# Altium schematic sheet Analogue_Input.SchDoc
size A4; SheetNumber: 14; SheetTotal: 29
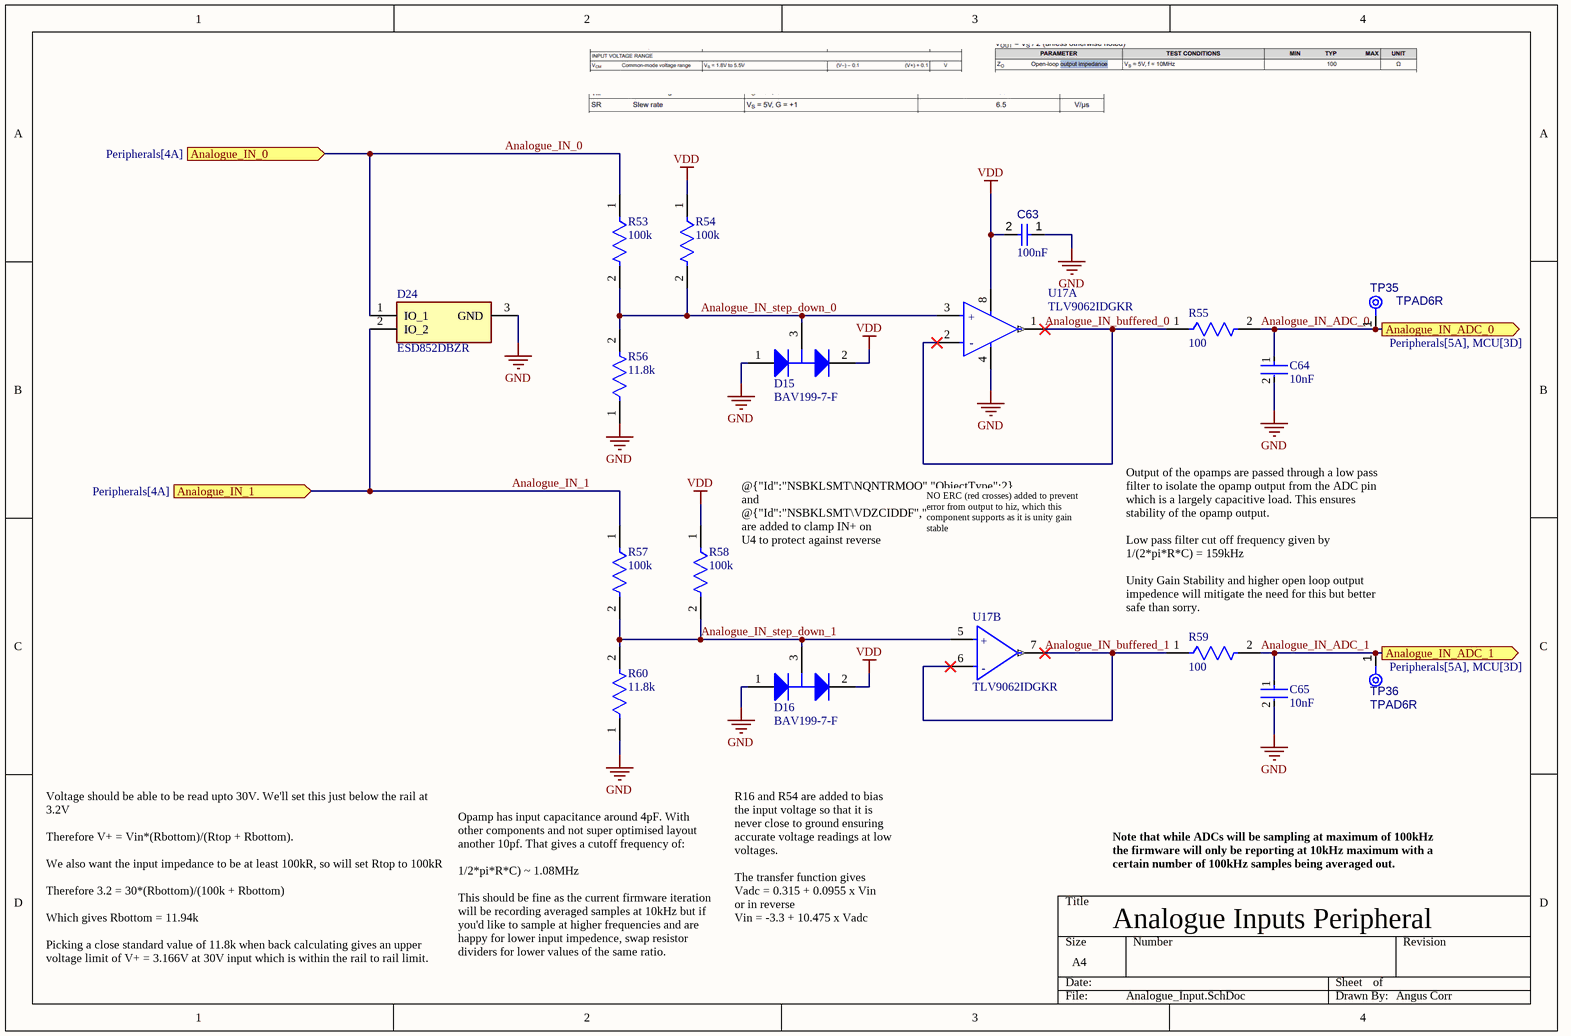
[diagram p0: Analogue_Input.SchDoc]

## Parts
C63  value 100nF  [CAPC1608X90X40NL10T20]  (hidden comment: Capacitor 100 nF +/-10% 50 V 0603)
C64  value 10nF  [FP-CC0603-DA-IPC_B]  (hidden comment: CC0603KRX7R9BB103)
C65  value 10nF  [FP-CC0603-DA-IPC_B]  (hidden comment: CC0603KRX7R9BB103)
D15  BAV199-7-F  [DIOD-SOT23-3_A_V]
D16  BAV199-7-F  [DIOD-SOT23-3_A_V]
D24  ESD852DBZR  [SOT95P237X112-3N]
R53  value 100k  [FP-RT0603-IPC_C]  (hidden comment: RT0603BRE07100KL)
R54  value 100k  [FP-RT0603-IPC_C]  (hidden comment: RT0603BRE07100KL)
R55  value 100  [FP-RT0603-IPC_C]  (hidden comment: RT0603BRD07100RL)
R56  value 11.8k  [FP-RT0603-IPC_A]  (hidden comment: RT0603BRD0711K8L)
R57  value 100k  [FP-RT0603-IPC_C]  (hidden comment: RT0603BRE07100KL)
R58  value 100k  [FP-RT0603-IPC_C]  (hidden comment: RT0603BRE07100KL)
R59  value 100  [FP-RT0603-IPC_C]  (hidden comment: RT0603BRD07100RL)
R60  value 11.8k  [FP-RT0603-IPC_A]  (hidden comment: RT0603BRD0711K8L)
TP35  TPAD6R  [TP06R]  (no BOM)
TP36  TPAD6R  [TP06R]  (no BOM)
U17  TLV9062IDGKR  [FP-DGK0008A-IPC_A]  (parts A,B of 2)

## Ports
Analogue_IN_0 (in, see Peripherals[4A]), Analogue_IN_1 (in, see Peripherals[4A]), Analogue_IN_ADC_0 (out, see Peripherals[5A], MCU[3D]), Analogue_IN_ADC_1 (out, see Peripherals[5A], MCU[3D])

## Nets
GND: C63.1 C64.2 C65.2 D15.1(A) D16.1(A) D24.3(GND) R56.1 R60.1 U17.4(V-)
VDD: C63.2 D15.2(K) D16.2(K) R54.1 R58.1 U17.8(V+)
Analogue_IN_0: D24.1(IO_1) R53.1 ; port Analogue_IN_0
Analogue_IN_1: D24.2(IO_2) R57.1 ; port Analogue_IN_1
Analogue_IN_ADC_0: C64.1 R55.2 TP35.1(TP) ; port Analogue_IN_ADC_0
Analogue_IN_ADC_1: C65.1 R59.2 TP36.1(TP) ; port Analogue_IN_ADC_1
Analogue_IN_buffered_0: R55.1 U17.1(OUT1) U17.2(IN1-)
Analogue_IN_buffered_1: R59.1 U17.6(IN2-) U17.7(OUT2)
Analogue_IN_step_down_0: D15.3(C) R53.2 R54.2 R56.2 U17.3(IN1+)
Analogue_IN_step_down_1: D16.3(C) R57.2 R58.2 R60.2 U17.5(IN2+)

## Notes on the sheet
- (near R58) @{"Id":"NSBKLSMT\NQNTRMOO","ObjectType":2} and @{"Id":"NSBKLSMT\VDZCIDDF","ObjectType":2} are added to clamp IN+ on U4 to protect against reverse bias and overvoltage.
- NO ERC (red crosses) added to prevent error from output to hiz, which this component supports as it is unity gain stable
- Output of the opamps are passed through a low pass filter to isolate the opamp output from the ADC pin which is a largely capacitive load. This ensures stability of the opamp output.
  Low pass filter cut off frequency given by 1/(2*pi*R*C) = 159kHz
  Unity Gain Stability and higher open loop output impedence will mitigate the need for this but better safe than sorry.
- Note that while ADCs will be sampling at maximum of 100kHz the firmware will only be reporting at 10kHz maximum with a certain number of 100kHz samples being averaged out.
- Voltage should be able to be read upto 30V. We'll set this just below the rail at 3.2V
  Therefore V+ = Vin*(Rbottom)/(Rtop + Rbottom).
  We also want the input impedance to be at least 100kR, so will set Rtop to 100kR
  Therefore 3.2 = 30*(Rbottom)/(100k + Rbottom)
  Which gives Rbottom = 11.94k
  Picking a close standard value of 11.8k when back calculating gives an upper voltage limit of V+ = 3.166V at 30V input which is within the rail to rail limit.
- Opamp has input capacitance around 4pF. With other components and not super optimised layout another 10pf. That gives a cutoff frequency of:
  1/2*pi*R*C) ~ 1.08MHz
  This should be fine as the current firmware iteration will be recording averaged samples at 10kHz but if you'd like to sample at higher frequencies and are happy for lower input impedence, swap resistor dividers for lower values of the same ratio.
- R16 and R54 are added to bias the input voltage so that it is never close to ground ensuring accurate voltage readings at low voltages.
  The transfer function gives
  Vadc = 0.315 + 0.0955 x Vin
  or in reverse
  Vin = -3.3 + 10.475 x Vadc
- Analogue Inputs Peripheral
- Angus Corr
- (in symbol CMP-014-00005-1, part A) +; -
- (in symbol CMP-014-00005-1, part B) +; -

## Library data of the parts
C63 = CMP-001-00017-6: Chip Capacitor, 100 nF, +/- 10%, 50 V, 0603 (1608 Metric); Voltage Rating: 50V; Capacitor Type: Ceramic; Tolerance: 10%; Mounting Technology: SM; Max Operating Temperature: 125°C; RoHS Compliant: True; Pins: 2; Case/Package: 0603; Min Operating Temperature: -55°C
C64 C65 = CMP-001-00138-1: 50V 10nF X7R ±10% 0603 Multilayer Ceramic Capacitors MLCC - SMD/SMT ROHS; Insulation Resistance: 100GΩ; Thickness: 889µm; China RoHS: Compliant; Export Control Classification Number (ECCN) Code: EAR99; Termination: SMD/SMT; Radiation Hardening: No; Voltage Rating: 50V; Depth: 800µm; Number of Terminals: 2; Max Operating Temperature: 125°C; Dielectric Material: Ceramic; Voltage Rating (DC): 50V; Dielectric: X7R; Composition: Ceramic; Mounting Technology: Surface Mount; Halogen Free: Halogen Free; Width: 800µm; Case Code (Metric): 1608; Min Operating Temperature: -55°C; Height: 800µm; Schedule B: 8532240020, 8532240020; Introduction Date: 2003-01-27; RoHS: Compliant; Length: 1.6mm; Voltage: 50V; Tolerance: 10%; Lifecycle Status: Production; Case/Package: 0603; Lead Free: Lead Free; Material: Ceramic; Country of Origin: Mainland China, Taiwan; Harmonized Tariff Schedule (HTS) Code: 8532.24.00.20; Case Code (Imperial): 0603; Pins: 2; REACH SVHC: Yes
D15 D16 = CMP-004-00056-1: Diode Standard Recovery Rectifier 85 Volt 0.16A 3-Pin SOT-23 Tape and Reel; Max Surge Current: 4A; Forward Current: 150mA; Forward Voltage: 900mV; Pins: 3; Case/Package: SOT-23; Max Operating Temperature: 150°C; Mounting Technology: Surface Mount; Min Operating Temperature: -65°C
D24 = CMP-031-00025-1: 61V (Typ) Clamp 4.3A (8/20s) Ipp Tvs Diode Surface Mount SOT-23-3; Manufacturer_Name: Texas Instruments; Datasheet Link: https://www.ti.com/lit/ds/symlink/esd852.pdf?ts=1728759309679&ref_url=https%253A%252F%252Fwww.mouser.com%252F; Arrow Price/Stock: https://www.arrow.com/en/products/esd852dbzr/texas-instruments?utm_currency=USD&region=nac; Height: 1.12mm; Mouser Price/Stock: https://www.mouser.co.uk/ProductDetail/Texas-Instruments/ESD852DBZR?qs=Z%252BL2brAPG1KJL96MCdc2ZA%3D%3D; Manufacturer_Part_Number: ESD852DBZR; Arrow Part Number: ESD852DBZR; Design Item ID: ESD852DBZR; Source: MAX17643ATC+.SchLib; Mouser Part Number: 595-ESD852DBZR
R53 R54 R57 R58 = CMP-009-00343-1: 100mW Thin Film Resistor 75V ±50ppm/℃ ±0.1% 100kΩ 0603 Chip Resistor - Surface Mount ROHS; Temperature Coefficient: 50ppm/°C; Voltage Rating (DC): 50V; Lead Free: Lead Free; Tolerance: 0.1%; Contact Plating: Tin; Schedule B: 8533210045, 8533210045; Composition: Thin Film; Features: Moisture Resistant; Case Code (Imperial): 0603; Depth: 800µm; Power Rating: 100mW; Case/Package: 0603; Number of Terminations: 2; REACH SVHC: Yes; Mounting Technology: Surface Mount; Working Voltage: 75V; RoHS: Compliant; Lifecycle Status: Production; Voltage Rating: 75V; Length: 1.6mm; Min Operating Temperature: -55°C; Military Standard: Not; Height: 450µm; Max Operating Temperature: 155°C; Max Power Dissipation: 100mW; Number of Terminals: 2; Radiation Hardening: No; Width: 800µm; China RoHS: Non-Compliant; Packaging: Tape & Reel (TR)
R55 R59 = CMP-009-00335-1: 100mW Thin Film Resistor 75V ±25ppm/℃ ±0.1% 100Ω 0603 Chip Resistor - Surface Mount ROHS; Temperature Coefficient: 25ppm/°C; Height: 450µm; Min Operating Temperature: -55°C; China RoHS: Non-Compliant; Power Rating: 100mW; Composition: Thin Film; Number of Terminals: 2; REACH SVHC: Yes; Tolerance: 0.1%; Length: 1.6mm; Mounting Technology: Surface Mount; Working Voltage: 75V; Lifecycle Status: Production; Voltage Rating: 75V; RoHS: Compliant; Width: 800µm; Max Operating Temperature: 155°C; Case/Package: 0603; Case Code (Imperial): 0603; Country of Origin: Mainland China, Taiwan; Depth: 800µm; Export Control Classification Number (ECCN) Code: EAR99; Features: Moisture Resistant; Harmonized Tariff Schedule (HTS) Code: 8533.21.00.30; Introduction Date: 2008-06-09; Lead Free: Lead Free; Max Power Dissipation: 100mW; Military Standard: Not; Number of Terminations: 2; Schedule B: 8533210045, 8533210045; Termination: SMD/SMT; Voltage Rating (DC): 75V; Weight: 2.012816mg
R56 R60 = CMP-009-00255-1: 100mW Thin Film Resistor ±25ppm/℃ ±0.1% 11.8kΩ 0603 Chip Resistor - Surface Mount ROHS; Voltage Rating: 75V; Min Operating Temperature: -55°C; Case/Package: 0603; Max Operating Temperature: 155°C; Tolerance: 0.1%; Mounting Technology: Surface Mount
TP35 TP36 = CMP-00028-00002-2: 0.6mm round; Pins: 1
U17 = CMP-014-00005-1: Dual, 5.5-V, 10-MHz operational amplifier 8-VSSOP -40 to 125; Min Supply Voltage: 1.8V; Max Supply Voltage: 5.5V; Pins: 8; Max Operating Temperature: 125°C; Case/Package: VSSOP; Min Operating Temperature: -40°C